# Altium schematic sheet 03_ Board Power.SchDoc
size 420 x 297 mm
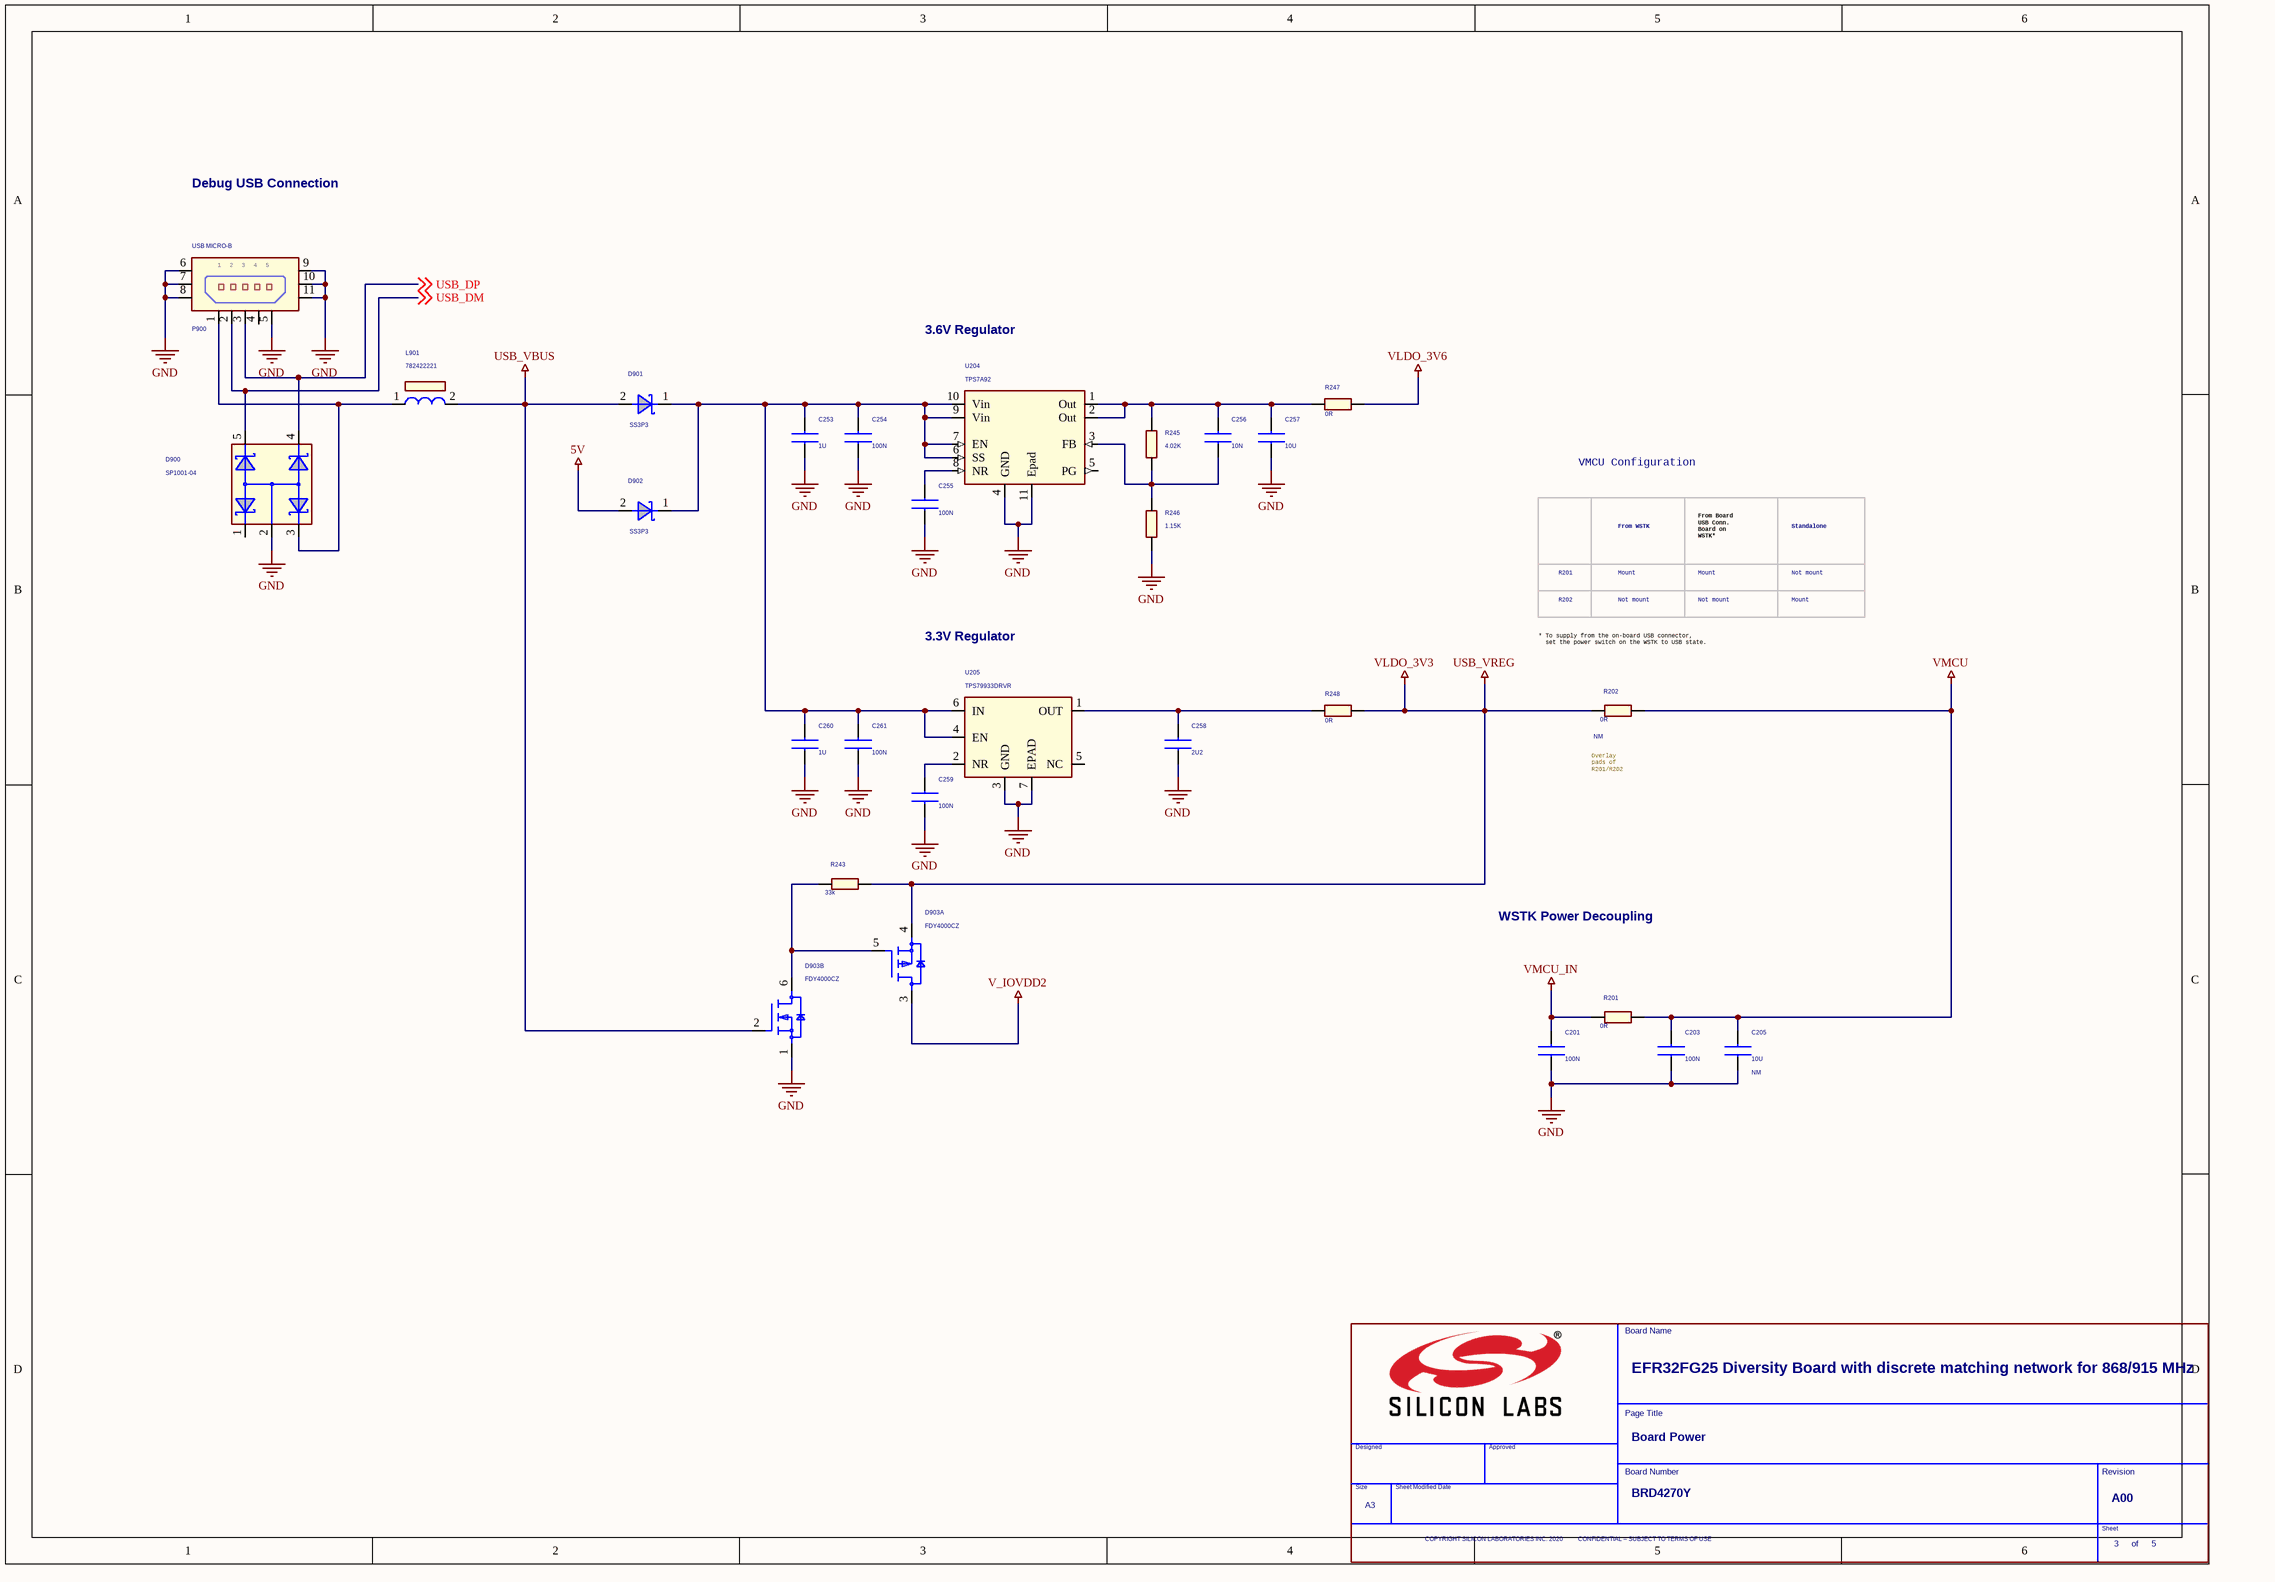
[diagram p0: 03_ Board Power.SchDoc]

## Parts
*  Title: EFR32FG25 Diversity Board with discrete matching network for 868/915 MHz  Page Count: 5  Page Number: 3  Page Size: A3  Page Title: Board Power  Board Number: BRD4270Y  RevCode: A00  (hidden comment: TitleBlock_SiliconLabs_A3)  (graphical)
C201  100N  [C0201_L]
C203  100N  [C0201_L]
C205  10U  Not Mounted: NM  [T_UNDEF]
C253  1U  [C0402_L]
C254  100N  [C0201_L]
C255  100N  [C0201_L]
C256  10N  [C0201_L]
C257  10U  [C0402_L]
C258  2U2  [C0402_L]
C259  100N  [C0201_L]
C260  1U  [C0402_L]
C261  100N  [C0201_L]
D900  SP1001-04  [SOT553_L]
D901  SS3P3  [DO-220AA]
D902  SS3P3  [DO-220AA]
D903  FDY4000CZ  [SOT-563]  (parts A,B of 2)
L901  782422221  [COIL_0402]
P900  USB MICRO-B  [AMP_FCI_10118194]
R201  0R  [R0402_L]
R202  0R  Not Mounted: NM  [R0402_L]
R243  33k  [R0402_L]
R245  4.02K  [R0201_L]
R246  1.15K  [R0201_L]
R247  0R  [R0603_L]
R248  0R  [R0603_L]
U204  TPS7A92  [WFDFN-10_EP_TPS7A92]
U205  TPS79933DRVR  [SON-6_EP_TPS79933DDCR]

## Nets
5V: D902.2(Anode)
GND: C201.2 C203.2 C205.2 C253.2 C254.2 C255.2 C257.2 C258.2 C259.2 C260.2 C261.2 D900.2 D903.1(S1) P900.5 P900.6 P900.7 P900.8 P900.9 P900.10 P900.11 R246.1 U204.4(GND) U204.11(Epad) U205.3(GND) U205.7(EPAD)
USB_VBUS: D901.2(Anode) D903.2(G1) L901.2
USB_VREG: D903.4(S2) R202.2 R243.1 R248.2  [also labelled VLDO_3V3]
V_IOVDD2: D903.3(D2)
VLDO_3V6: R247.2
VMCU: C203.1 C205.1 R201.1 R202.1
VMCU_IN: C201.1 R201.2
USB_DM: D900.5 P900.2 ; off-sheet USB_DM
USB_DP: D900.4 P900.3 ; off-sheet USB_DP
NetC253_1: C253.1 C254.1 C260.1 C261.1 D901.1(Cathode) D902.1(Cathode) U204.6(SS) U204.7(EN) U204.9(Vin) U204.10(Vin) U205.4(EN) U205.6(IN)
NetC255_1: C255.1 U204.8(NR)
NetC256_1: C256.1 C257.1 R245.2 R247.1 U204.1(Out) U204.2(Out)
NetC256_2: C256.2 R245.1 R246.2 U204.3(FB)
NetC258_1: C258.1 R248.1 U205.1(OUT)
NetC259_1: C259.1 U205.2(NR)
NetD900_3: D900.3 L901.1 P900.1
NetD903_5: D903.5(G5) D903.6(D1) R243.2

Not connected (* = marked no-connect by the designer): D900 1; P900 4; U204 5(PG); U205 5(NC)

## Notes on the sheet
- Debug USB Connection
- 3.6V Regulator
- VMCU Configuration
- From WSTK
- Standalone
- R201
- Mount
- From Board
  USB Conn.
  Board on
  WSTK*
- Not mount
- 3.3V Regulator
- * To supply from the on-board USB connector,
  set the power switch on the WSTK to USB state.
- R202
- (near R202) Overlay
  pads of
  R201/R202
- WSTK Power Decoupling
- (in symbol TitleBlock_SiliconLabs_A3) Board Name; Page Title; Designed; Approved; Board Number; Revision; Size; Sheet Modified Date; Sheet; COPYRIGHT SILICON LABORATORIES INC. 2020          CONFIDENTIAL – SUBJECT TO TERMS OF USE; of

## Library data of the parts
* = TitleBlock_SiliconLabs_A3: Board Approver: RGU; OrgName: Silicon Labs
C201 C203 C254 C255 C259 C261 = C0201: Rating: 16V; Tolerance: 20%; Technology: X7S
C205 = CAPACITOR: Technology: X7R
C253 C258 C260 = C0402: Rating: 6.3V; Tolerance: 10%
  C253 C260: Technology: X7R
  C258: Technology: X7S
C256 = C0201: Rating: 16V; Tolerance: 10%; Technology: X7R
C257 = C0402: Rating: 6.3V; Tolerance: 20%; Technology: X6S
D900 = SP1001-04: Mfg: Littlefuse; Mfg #: SP1001-04XTG; Price_1K: 0.187
D901 D902 = SS3P3: Mfg: Vishay; Mfg #: SS3P3-M3/84A; Price_1K: 0.12
D903 = FDY4000CZ: Mfg: ON Semiconductor; Mfg #: FDY4000CZ
L901 = WE-CBA: Mfg: Würth Elektronik; Price_1K: 0.02; Mfg #: 782422221
P900 = KLS L-KLS1-238-0-0-0: Mfg: KLS; Mfg #: L-KLS1-238-0-0-0-R; Price_1K: 0.20
R201 R202 R243 = R0402: Price_1K: 0.005
R245 R246 = R0201: Price_1K: 0.005
R247 R248 = R0603: Price_1K: 0.005
U204 = TPS7A92: Mfg #: TPS7A9201DSKR; Mfg: Texas Instruments; Price 1k: 1.2
U205 = TPS79933DRVR: Mfg: Texas Instruments; Price 1k: 0.38; Mfg #: TPS79933DRVR